# Altium project UE_Frequency_Converter.PrjPcb (part 2 of 2)

## Sheet Buck_TPSM82913_3V7.SchDoc
size B; SheetNumber: 12; SheetTotal: 15
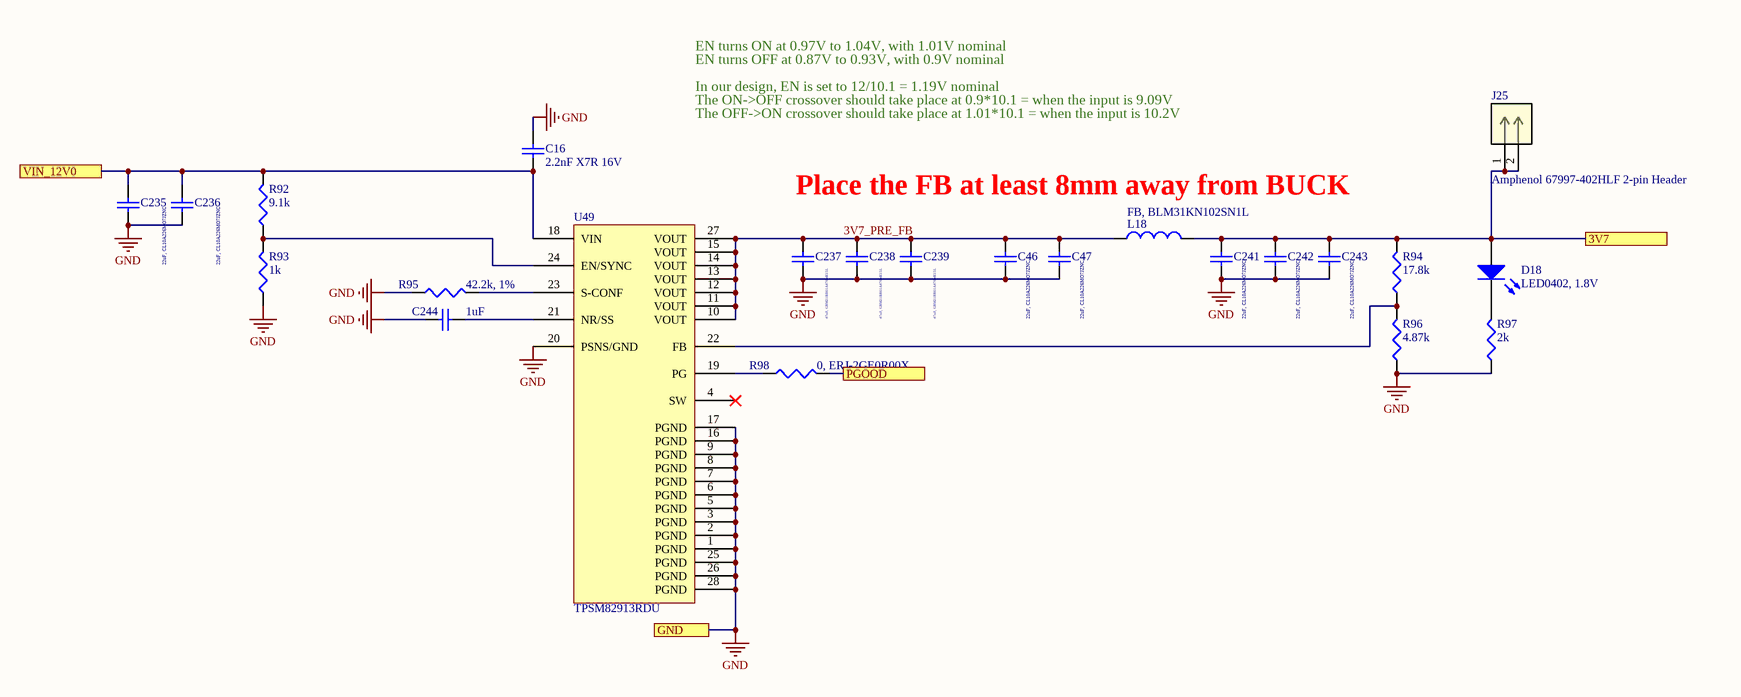
[diagram p11: Buck_TPSM82913_3V7.SchDoc]

### Parts
C16  2.2nF X7R 16V  [SMD-0402]
C46  22uF, CL10A226MO7JZNC  [SMD-0603]
C47  22uF, CL10A226MO7JZNC  [SMD-0603]
C235  22uF, CL10A226MO7JZNC  [SMD-0603]
C236  22uF, CL10A226MO7JZNC  [SMD-0603]
C237  47uF, GRM21BR61A476ME15L  [SMD-0805]
C238  47uF, GRM21BR61A476ME15L  [SMD-0805]
C239  47uF, GRM21BR61A476ME15L  [SMD-0805]
C241  22uF, CL10A226MO7JZNC  [SMD-0603]
C242  22uF, CL10A226MO7JZNC  [SMD-0603]
C243  22uF, CL10A226MO7JZNC  [SMD-0603]
C244  1uF  [SMD-0402]
D18  LED0402, 1.8V  [LED-0402]
J25  Amphenol 67997-402HLF 2-pin Header  [Amphenol  67997-402HLF 2-pin header]
L18  FB, BLM31KN102SN1L  [SMD-1206]
R92  9.1k  [SMD-0402]
R93  1k  [SMD-0402]
R94  17.8k  [SMD-0402]
R95  42.2k, 1%  [SMD-0402]
R96  4.87k  [SMD-0402]
R97  2k  [SMD-0402]
R98  0, ERJ-2GE0R00X  [SMD-0402]
U49  TPSM82913RDU  [TPSM82913DRUR]

### Ports
3V7 (see Main[2D], IQ_Mod[4D]), GND (see Main[2D], 3V7_to_3V3_LDO[1B], 5V5_to_5V0_LDO[1C], Buck_TPSM82913_1V8[3C], Buck_TPSM82913_5V0[3C], Buck_TPSM82913_5V5[2C], Clocking_and_LO[2A], Fan_Interfaces[2B], IQ_Demod[1C], IQ_Mod[1B], LMX2820[4D], Microzed_Interfaces[1A], Power_Supply[6B], Voltage_Conv_Bidirectional[1B]), PGOOD (see Main[1D]), VIN_12V0 (see Main[1D], Buck_TPSM82913_5V0[1B], Buck_TPSM82913_5V5[1B])

### Nets
3V7_Buck: C241.2 C242.2 C243.2 D18.1(A) J25.1 J25.2 L18.2 R94.2 ; port 3V7
12V0: C16.1 C235.2 C236.2 R92.2 U49.18(VIN) ; port VIN_12V0
GND: C16.2 C46.1 C47.1 C235.1 C236.1 C237.1 C238.1 C239.1 C241.1 C242.1 C243.1 C244.1 R93.1 R95.1 R96.1 R97.1 U49.1(PGND) U49.2(PGND) U49.3(PGND) U49.5(PGND) U49.6(PGND) U49.7(PGND) U49.8(PGND) U49.9(PGND) U49.16(PGND) U49.17(PGND) U49.20(PSNS/GND) U49.25(PGND) U49.26(PGND) U49.28(PGND) ; port GND
3V7_PRE_FB: C46.2 C47.2 C237.2 C238.2 C239.2 L18.1 U49.10(VOUT) U49.11(VOUT) U49.12(VOUT) U49.13(VOUT) U49.14(VOUT) U49.15(VOUT) U49.27(VOUT)
NetC244_2: C244.2 U49.21(NR/SS)
NetD18_2: D18.2(K) R97.2
NetR92_1: R92.1 R93.2 U49.24(EN/SYNC)
NetR94_1: R94.1 R96.2 U49.22(FB)
NetR95_2: R95.2 U49.23(S-CONF)
NetR98_1: R98.1 U49.19(PG)
NetR98_2: R98.2 ; port PGOOD

Not connected (* = marked no-connect by the designer): U49 4(SW)*

### Notes on the sheet
- EN turns OFF at 0.87V to 0.93V, with 0.9V nominal
- EN turns ON at 0.97V to 1.04V, with 1.01V nominal
- In our design, EN is set to 12/10.1 = 1.19V nominal
- The ON->OFF crossover should take place at 0.9*10.1 = when the input is 9.09V
- The OFF->ON crossover should take place at 1.01*10.1 = when the input is 10.2V
- Place the FB at least 8mm away from BUCK

### Library data of the parts
C16 C244 = CAP0402: Ceramic Capacitor 0402
C46 C47 C235 C236 C241-C243 = CAP0603: Ceramic Capacitor 0603
C237-C239 = CAP0805: as C100 on sheet Power_Supply
D18 = LED0402: LED 0402
J25 = Amphenol 67997-402HLF 2-pin Header: as J2 on sheet Power_Supply; RefDes: RefDes; Type: Type
L18 = L1206: Inductor 1206
R92-R98 = RES0402: Resistor-0402

## Sheet Buck_TPSM82913_5V5.SchDoc
size B; SheetNumber: 13; SheetTotal: 15
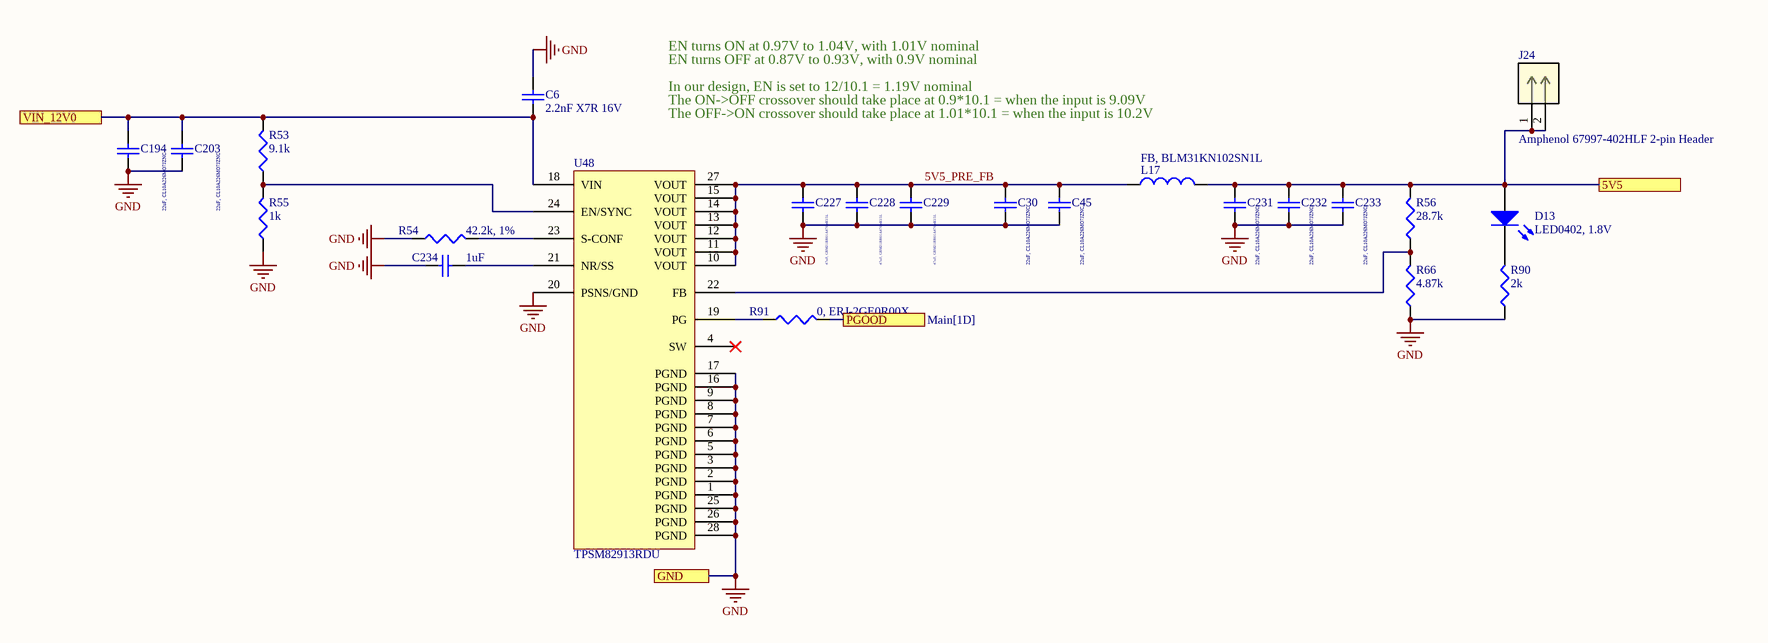
[diagram p12: Buck_TPSM82913_5V5.SchDoc]

### Parts
C6  2.2nF X7R 16V  [SMD-0402]
C30  22uF, CL10A226MO7JZNC  [SMD-0603]
C45  22uF, CL10A226MO7JZNC  [SMD-0603]
C194  22uF, CL10A226MO7JZNC  [SMD-0603]
C203  22uF, CL10A226MO7JZNC  [SMD-0603]
C227  47uF, GRM21BR61A476ME15L  [SMD-0805]
C228  47uF, GRM21BR61A476ME15L  [SMD-0805]
C229  47uF, GRM21BR61A476ME15L  [SMD-0805]
C231  22uF, CL10A226MO7JZNC  [SMD-0603]
C232  22uF, CL10A226MO7JZNC  [SMD-0603]
C233  22uF, CL10A226MO7JZNC  [SMD-0603]
C234  1uF  [SMD-0402]
D13  LED0402, 1.8V  [LED-0402]
J24  Amphenol 67997-402HLF 2-pin Header  [Amphenol  67997-402HLF 2-pin header]
L17  FB, BLM31KN102SN1L  [SMD-1206]
R53  9.1k  [SMD-0402]
R54  42.2k, 1%  [SMD-0402]
R55  1k  [SMD-0402]
R56  28.7k  [SMD-0402]
R66  4.87k  [SMD-0402]
R90  2k  [SMD-0402]
R91  0, ERJ-2GE0R00X  [SMD-0402]
U48  TPSM82913RDU  [TPSM82913DRUR]

### Ports
5V5 (see Main[2D], IQ_Demod[1D]), GND (see Main[2D], 3V7_to_3V3_LDO[1B], 5V5_to_5V0_LDO[1C], Buck_TPSM82913_1V8[3C], Buck_TPSM82913_3V7[3C], Buck_TPSM82913_5V0[3C], Clocking_and_LO[2A], Fan_Interfaces[2B], IQ_Demod[1C], IQ_Mod[1B], LMX2820[4D], Microzed_Interfaces[1A], Power_Supply[6B], Voltage_Conv_Bidirectional[1B]), PGOOD (see Main[1D]), VIN_12V0 (see Main[1D], Buck_TPSM82913_3V7[1B], Buck_TPSM82913_5V0[1B])

### Nets
5V5_Buck: C231.2 C232.2 C233.2 D13.1(A) J24.1 J24.2 L17.2 R56.2 ; port 5V5
12V0: C6.1 C194.2 C203.2 R53.2 U48.18(VIN) ; port VIN_12V0
GND: C6.2 C30.1 C45.1 C194.1 C203.1 C227.1 C228.1 C229.1 C231.1 C232.1 C233.1 C234.1 R54.1 R55.1 R66.1 R90.1 U48.1(PGND) U48.2(PGND) U48.3(PGND) U48.5(PGND) U48.6(PGND) U48.7(PGND) U48.8(PGND) U48.9(PGND) U48.16(PGND) U48.17(PGND) U48.20(PSNS/GND) U48.25(PGND) U48.26(PGND) U48.28(PGND) ; port GND
5V5_PRE_FB: C30.2 C45.2 C227.2 C228.2 C229.2 L17.1 U48.10(VOUT) U48.11(VOUT) U48.12(VOUT) U48.13(VOUT) U48.14(VOUT) U48.15(VOUT) U48.27(VOUT)
NetC234_2: C234.2 U48.21(NR/SS)
NetD13_2: D13.2(K) R90.2
NetR53_1: R53.1 R55.2 U48.24(EN/SYNC)
NetR54_2: R54.2 U48.23(S-CONF)
NetR56_1: R56.1 R66.2 U48.22(FB)
NetR91_1: R91.1 U48.19(PG)
NetR91_2: R91.2 ; port PGOOD

Not connected (* = marked no-connect by the designer): U48 4(SW)*

### Notes on the sheet
- EN turns OFF at 0.87V to 0.93V, with 0.9V nominal
- EN turns ON at 0.97V to 1.04V, with 1.01V nominal
- In our design, EN is set to 12/10.1 = 1.19V nominal
- The ON->OFF crossover should take place at 0.9*10.1 = when the input is 9.09V
- The OFF->ON crossover should take place at 1.01*10.1 = when the input is 10.2V

### Library data of the parts
C6 C234 = CAP0402: Ceramic Capacitor 0402
C30 C45 C194 C203 C231-C233 = CAP0603: Ceramic Capacitor 0603
C227-C229 = CAP0805: Ceramic Capacitor 0805 Imperial (2012 Metric)
D13 = LED0402: LED 0402
J24 = Amphenol 67997-402HLF 2-pin Header: No Description Available; Mfr_Name: Amphenol ICC; RefDes: RefDes; Type: Type
L17 = L1206: Inductor 1206
R53-R56 R66 R90 R91 = RES0402: Resistor-0402

## Sheet Voltage_Conv_Bidirectional.SchDoc
size A; SheetNumber: 14; SheetTotal: 14
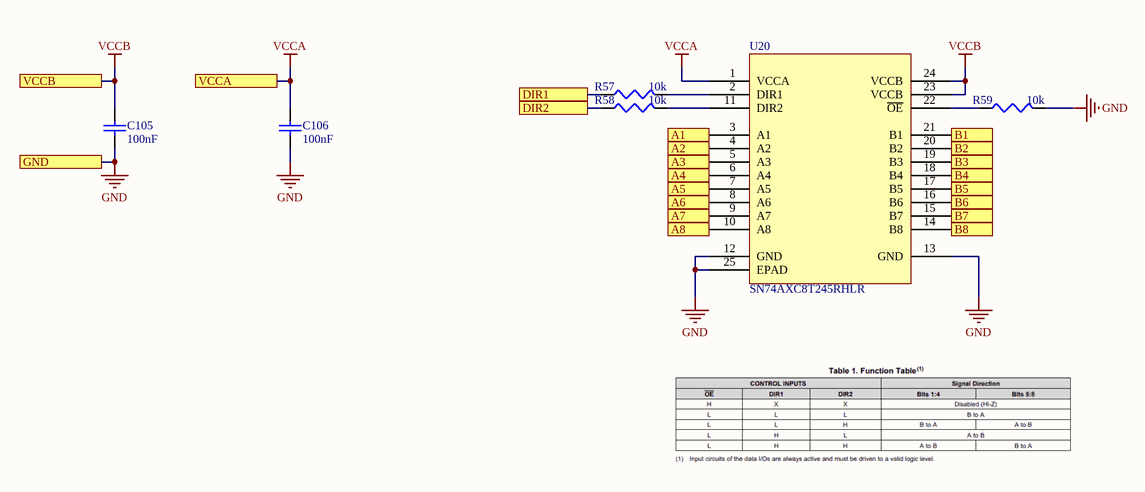
[diagram p13: Voltage_Conv_Bidirectional.SchDoc]

### Parts
C105  100nF  [SMD-0402]
C106  100nF  [SMD-0402]
R57  10k  [SMD-0402]
R58  10k  [SMD-0402]
R59  10k  [SMD-0402]
U20  SN74AXC8T245RHLR  [RHL0024A]

### Ports
A1 (see Main[4B]), A2 (see Main[4B]), A3 (see Main[4B]), A4 (see Main[4B]), A5 (see Main[4B]), A6 (see Main[4B]), A7 (see Main[4B]), A8 (see Main[4B]), B1 (see Main[5B]), B2 (see Main[5B]), B3 (see Main[5B]), B4 (see Main[5B]), B5 (see Main[5B]), B6 (see Main[5B]), B7 (see Main[5B]), B8 (see Main[5B]), DIR1 (see Main[4B]), DIR2 (see Main[4C]), GND (see Main[5C], 3V7_to_3V3_LDO[1B], 5V5_to_5V0_LDO[1C], Buck_TPSM82913_1V8[3C], Buck_TPSM82913_3V7[3C], Buck_TPSM82913_5V0[3C], Buck_TPSM82913_5V5[2C], Clocking_and_LO[2A], IQ_Demod[1C], IQ_Mod[1B], LMX2820[4D], Microzed_Interfaces[1A], Power_Supply[6B]), VCCA (see Main[4B]), VCCB (see Main[5B])

### Nets
GND: C105.1 C106.1 R59.2 U20.12(GND) U20.13(GND) U20.25(EPAD) ; port GND
VCCA: C106.2 R57.1 R58.1 U20.1(VCCA) ; port VCCA, port DIR1, port DIR2  [project net 1V8]
VCCB: C105.2 U20.23(VCCB) U20.24(VCCB) ; port VCCB  [project net 3V3]
CLK_SW_1V8: U20.3(A1) ; port A1
CLK_SW_3V3: U20.21(B1) ; port B1
LMX_A_LD_1V8: U20.7(A5) ; port A5
LMX_A_LD_3V3: U20.17(B5) ; port B5
LMX_B_LD_1V8: U20.8(A6) ; port A6
LMX_B_LD_3V3: U20.16(B6) ; port B6
SPI_MISO_1V8: U20.9(A7) ; port A7
SPI_MISO_3V3: U20.15(B7) ; port B7
NetR57_2: R57.2 U20.2(DIR1)
NetR58_2: R58.2 U20.11(DIR2)
NetR59_1: R59.1 U20.22(~{OE})
NetU20_4: U20.4(A2) ; port A2
NetU20_5: U20.5(A3) ; port A3
NetU20_6: U20.6(A4) ; port A4
NetU20_10: U20.10(A8) ; port A8
NetU20_14: U20.14(B8) ; port B8
NetU20_18: U20.18(B4) ; port B4
NetU20_19: U20.19(B3) ; port B3
NetU20_20: U20.20(B2) ; port B2

### Library data of the parts
C105 C106 = CAP0402: Ceramic Capacitor 0402
R57-R59 = RES0402: Resistor-0402
U20 = SN74AXC8T245

## Sheet Fan_Interfaces.SchDoc
size A; SheetNumber: 15; SheetTotal: 15
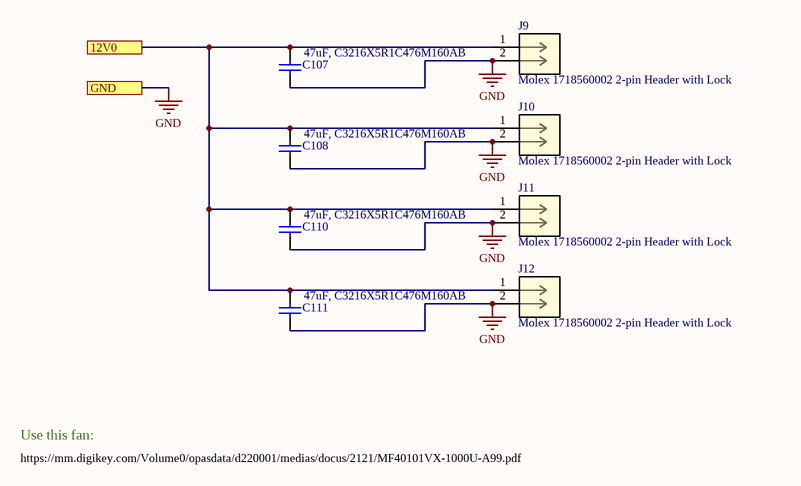
[diagram p14: Fan_Interfaces.SchDoc]

### Parts
C107  47uF, C3216X5R1C476M160AB  [SMD-1206]
C108  47uF, C3216X5R1C476M160AB  [SMD-1206]
C110  47uF, C3216X5R1C476M160AB  [SMD-1206]
C111  47uF, C3216X5R1C476M160AB  [SMD-1206]
J9  Molex 1718560002 2-pin Header with Lock  [Molex 1718560002 2-pin header with lock]
J10  Molex 1718560002 2-pin Header with Lock  [Molex 1718560002 2-pin header with lock]
J11  Molex 1718560002 2-pin Header with Lock  [Molex 1718560002 2-pin header with lock]
J12  Molex 1718560002 2-pin Header with Lock  [Molex 1718560002 2-pin header with lock]

### Ports
12V0 (see Main[2C], Microzed_Interfaces[3B]), GND (see Main[3C], 3V7_to_3V3_LDO[1B], 5V5_to_5V0_LDO[1C], Buck_TPSM82913_1V8[3C], Buck_TPSM82913_3V7[3C], Buck_TPSM82913_5V0[3C], Buck_TPSM82913_5V5[2C], Clocking_and_LO[2A], IQ_Demod[1C], IQ_Mod[1B], LMX2820[4D], Microzed_Interfaces[1A], Power_Supply[6B], Voltage_Conv_Bidirectional[1B])

### Nets
12V0: C107.2 C108.2 C110.2 C111.2 J9.1 J10.1 J11.1 J12.1 ; port 12V0
GND: C107.1 C108.1 C110.1 C111.1 J9.2 J10.2 J11.2 J12.2 ; port GND

### Notes on the sheet
- https://mm.digikey.com/Volume0/opasdata/d220001/medias/docus/2121/MF40101VX-1000U-A99.pdf
- Use this fan:

### Library data of the parts
C107 C108 C110 C111 = CAP1206: Ceramic Capacitor 1206 Imperial
J9-J12 = Molex 1718560002 2-pin Header with Lock: No Description Available; Mfr_Name: Molex Connector Corporation; RefDes: RefDes; Type: Type

## Nets that join several sheets
1V8: IQ_Demod_TX (U7_2.7 U7_2.24), IQ_Demod_RX (U7_1.7 U7_1.24), Microzed_Interfaces (7 pins), Buck_TPSM82913_1V8 (6 pins), Voltage_Conv_Bidirectional (C106.2 R57.1 R58.1 U20.1)
3V3: Clocking_and_LO (FB2.1 FB3.1 FB4.1), U_Clocking_and_LO/U_3V7_to_3V3_LDO_LMK (5 pins), Voltage_Conv_Bidirectional (C105.2 U20.23 U20.24)
3V3_LDO_Crystal: Clocking_and_LO (C65.2 U14.3), U_Clocking_and_LO/U_3V7_to_3V3_LDO_Crystal (5 pins)
3V3_LDO_LMX: U_Clocking_and_LO/LMX2820_A (18 pins), U_Clocking_and_LO/LMX2820_A/U_3V7_to_3V3_LDO (5 pins)
3V3_LDO_LMX: U_Clocking_and_LO/LMX2820_B (18 pins), U_Clocking_and_LO/LMX2820_B/U_3V7_to_3V3_LDO (5 pins)
3V7_Buck: IQ_Mod_TX/U_3V7_to_3V3_LDO (C2_2.2 R2_2.2 U1_2.7 U1_2.8), IQ_Mod_RX/U_3V7_to_3V3_LDO (C2_1.2 R2_1.2 U1_1.7 U1_1.8), U_Clocking_and_LO/LMX2820_A/U_3V7_to_3V3_LDO (C2_3.2 R2_3.2 U1_3.7 U1_3.8), U_Clocking_and_LO/LMX2820_B/U_3V7_to_3V3_LDO (C2_4.2 R2_4.2 U1_4.7 U1_4.8), U_Clocking_and_LO/U_3V7_to_3V3_LDO_LMK (C2_6.2 R2_6.2 U1_6.7 U1_6.8), U_Clocking_and_LO/U_3V7_to_3V3_LDO_Crystal (C2_5.2 R2_5.2 U1_5.7 U1_5.8), Buck_TPSM82913_3V7 (8 pins)
5V0_Zynq: Microzed_Interfaces (9 pins), Buck_TPSM82913_5V0 (6 pins), Buck_TPSM82913_1V8 (C82.1 C83.2 C84.2 U17.18)
5V5_Buck: IQ_Demod_TX/U_5V5_to_5V0_LDO (C30_2.2 R17_2.2 U12_2.7 U12_2.8), IQ_Demod_RX/U_5V5_to_5V0_LDO (C30_1.2 R17_1.2 U12_1.7 U12_1.8), Buck_TPSM82913_5V5 (8 pins)
12V0: Main (D6.2), Power_Supply (11 pins), Buck_TPSM82913_5V0 (6 pins), Buck_TPSM82913_3V7 (5 pins), Buck_TPSM82913_5V5 (5 pins), Fan_Interfaces (8 pins)
GND: Main (12 pins), IQ_Mod_TX (39 pins), IQ_Mod_TX/U_3V7_to_3V3_LDO (8 pins), IQ_Demod_TX (58 pins), IQ_Demod_TX/U_5V5_to_5V0_LDO (8 pins), IQ_Mod_RX (39 pins), IQ_Mod_RX/U_3V7_to_3V3_LDO (8 pins), IQ_Demod_RX (58 pins), IQ_Demod_RX/U_5V5_to_5V0_LDO (8 pins), Clocking_and_LO (12 pins), U_Clocking_and_LO/LMX2820_A (39 pins), U_Clocking_and_LO/LMX2820_A/U_3V7_to_3V3_LDO (8 pins), U_Clocking_and_LO/LMX2820_B (39 pins), U_Clocking_and_LO/LMX2820_B/U_3V7_to_3V3_LDO (8 pins), U_Clocking_and_LO/U_3V7_to_3V3_LDO_LMK (8 pins), U_Clocking_and_LO/U_3V7_to_3V3_LDO_Crystal (8 pins), Power_Supply (13 pins), Microzed_Interfaces (50 pins), Buck_TPSM82913_5V0 (31 pins), Buck_TPSM82913_1V8 (29 pins), Buck_TPSM82913_3V7 (30 pins), Buck_TPSM82913_5V5 (30 pins), Voltage_Conv_Bidirectional (6 pins), Fan_Interfaces (8 pins)
VCCD_IQ_MOD: IQ_Mod_TX (6 pins), IQ_Mod_TX/U_3V7_to_3V3_LDO (5 pins)
VCCD_IQ_MOD: IQ_Mod_RX (6 pins), IQ_Mod_RX/U_3V7_to_3V3_LDO (5 pins)
5V0_LDO: IQ_Demod_TX (C28_2.1 U7_2.18), IQ_Demod_TX/U_5V5_to_5V0_LDO (5 pins)
5V0_LDO: IQ_Demod_RX (C28_1.1 U7_1.18), IQ_Demod_RX/U_5V5_to_5V0_LDO (5 pins)
CLK_SW_1V8: Microzed_Interfaces (JX1.83), Voltage_Conv_Bidirectional (U20.3)
CLK_SW_3V3: Clocking_and_LO (U15.7), Voltage_Conv_Bidirectional (U20.21)
LMX_A_LD_1V8: Microzed_Interfaces (JX1.74), Voltage_Conv_Bidirectional (U20.7)
LMX_A_LD_3V3: Main (D8.2), U_Clocking_and_LO/LMX2820_A (U13_1.38), Voltage_Conv_Bidirectional (U20.17)
LMX_A_PSYNC_1V8: U_Clocking_and_LO/LMX2820_A (R21_1.1), Microzed_Interfaces (JX1.82)
LMX_B_LD_1V8: Microzed_Interfaces (JX1.76), Voltage_Conv_Bidirectional (U20.8)
LMX_B_LD_3V3: Main (D7.2), U_Clocking_and_LO/LMX2820_B (U13_2.38), Voltage_Conv_Bidirectional (U20.16)
LMX_B_PSYNC_1V8: U_Clocking_and_LO/LMX2820_B (R21_2.1), Microzed_Interfaces (JX1.38)
LO_A_N: IQ_Demod_TX (U9_2.8), U_Clocking_and_LO/LMX2820_A (C43_1.2)
LO_A_P: IQ_Mod_RX (U2_1.8), U_Clocking_and_LO/LMX2820_A (C44_1.2)
LO_B_N: IQ_Mod_TX (U2_2.8), U_Clocking_and_LO/LMX2820_B (C43_2.2)
LO_B_P: IQ_Demod_RX (U9_1.8), U_Clocking_and_LO/LMX2820_B (C44_2.2)
NetC9_1_2: Main (J6.S), IQ_Mod_RX (C9_1.2)
NetC9_2_2: Main (J4.S), IQ_Mod_TX (C9_2.2)
NetC58_1_2: Clocking_and_LO (R30.2), U_Clocking_and_LO/LMX2820_A (C58_1.2 R28_1.2)
NetC58_2_2: Clocking_and_LO (R31.2), U_Clocking_and_LO/LMX2820_B (C58_2.2 R28_2.2)
NetJ3_S: Main (J3.S), IQ_Demod_TX (U8_2.8)
NetJ5_S: Main (J5.S), IQ_Demod_RX (U8_1.8)
NetJ7_S: Main (J7.S), Clocking_and_LO (R32.2)
NetJ8_S: Main (J8.S), Clocking_and_LO (U15.8)
NetJX2_10: Microzed_Interfaces (JX2.10), Buck_TPSM82913_1V8 (R41.1)
NetJX2_11: Microzed_Interfaces (JX2.11), Buck_TPSM82913_1V8 (R46.2)
OP_IF_N: IQ_Mod_TX (R10_2.2 U3_2.9), IQ_Demod_TX (U10_2.4)
OP_IF_N: IQ_Mod_RX (R10_1.2 U3_1.9), IQ_Demod_RX (U10_1.4)
OP_IF_P: IQ_Mod_TX (R9_2.2 U3_2.10), IQ_Demod_TX (U11_2.4)
OP_IF_P: IQ_Mod_RX (R9_1.2 U3_1.10), IQ_Demod_RX (U11_1.4)
OP_QF_N: IQ_Mod_TX (R7_2.2 U3_2.21), IQ_Demod_TX (U5_2.4)
OP_QF_N: IQ_Mod_RX (R7_1.2 U3_1.21), IQ_Demod_RX (U5_1.4)
OP_QF_P: IQ_Mod_TX (R8_2.2 U3_2.22), IQ_Demod_TX (U6_2.4)
OP_QF_P: IQ_Mod_RX (R8_1.2 U3_1.22), IQ_Demod_RX (U6_1.4)
SPI_5594_RX_SENb_1V8: IQ_Demod_RX (U7_1.17), Microzed_Interfaces (JX1.9)
SPI_5594_TX_SENb_1V8: IQ_Demod_TX (U7_2.17), Microzed_Interfaces (JX2.90)
SPI_LMX_A_SENb_1V8: Main (TP3.1), U_Clocking_and_LO/LMX2820_A (U13_1.39), Microzed_Interfaces (JX1.62)
SPI_LMX_B_SENb_1V8: U_Clocking_and_LO/LMX2820_B (U13_2.39), Microzed_Interfaces (JX1.12)
SPI_MISO_1V8: Microzed_Interfaces (JX1.81), Voltage_Conv_Bidirectional (U20.9)
SPI_MISO_3V3: U_Clocking_and_LO/LMX2820_A (R23_1.2), U_Clocking_and_LO/LMX2820_B (R23_2.2), Voltage_Conv_Bidirectional (U20.15)
SPI_MOSI_1V8: Main (TP1.1), IQ_Demod_TX (U7_2.22), IQ_Demod_RX (U7_1.22), U_Clocking_and_LO/LMX2820_A (U13_1.19), U_Clocking_and_LO/LMX2820_B (U13_2.19), Microzed_Interfaces (JX2.81)
SPI_SCLK_1V8: Main (TP2.1), IQ_Demod_TX (U7_2.23), IQ_Demod_RX (U7_1.23), U_Clocking_and_LO/LMX2820_A (U13_1.18), U_Clocking_and_LO/LMX2820_B (U13_2.18), Microzed_Interfaces (JX2.83)